# Altium schematic sheet USB-PD.SchDoc
size A3; SheetNumber: 3; SheetTotal: 8
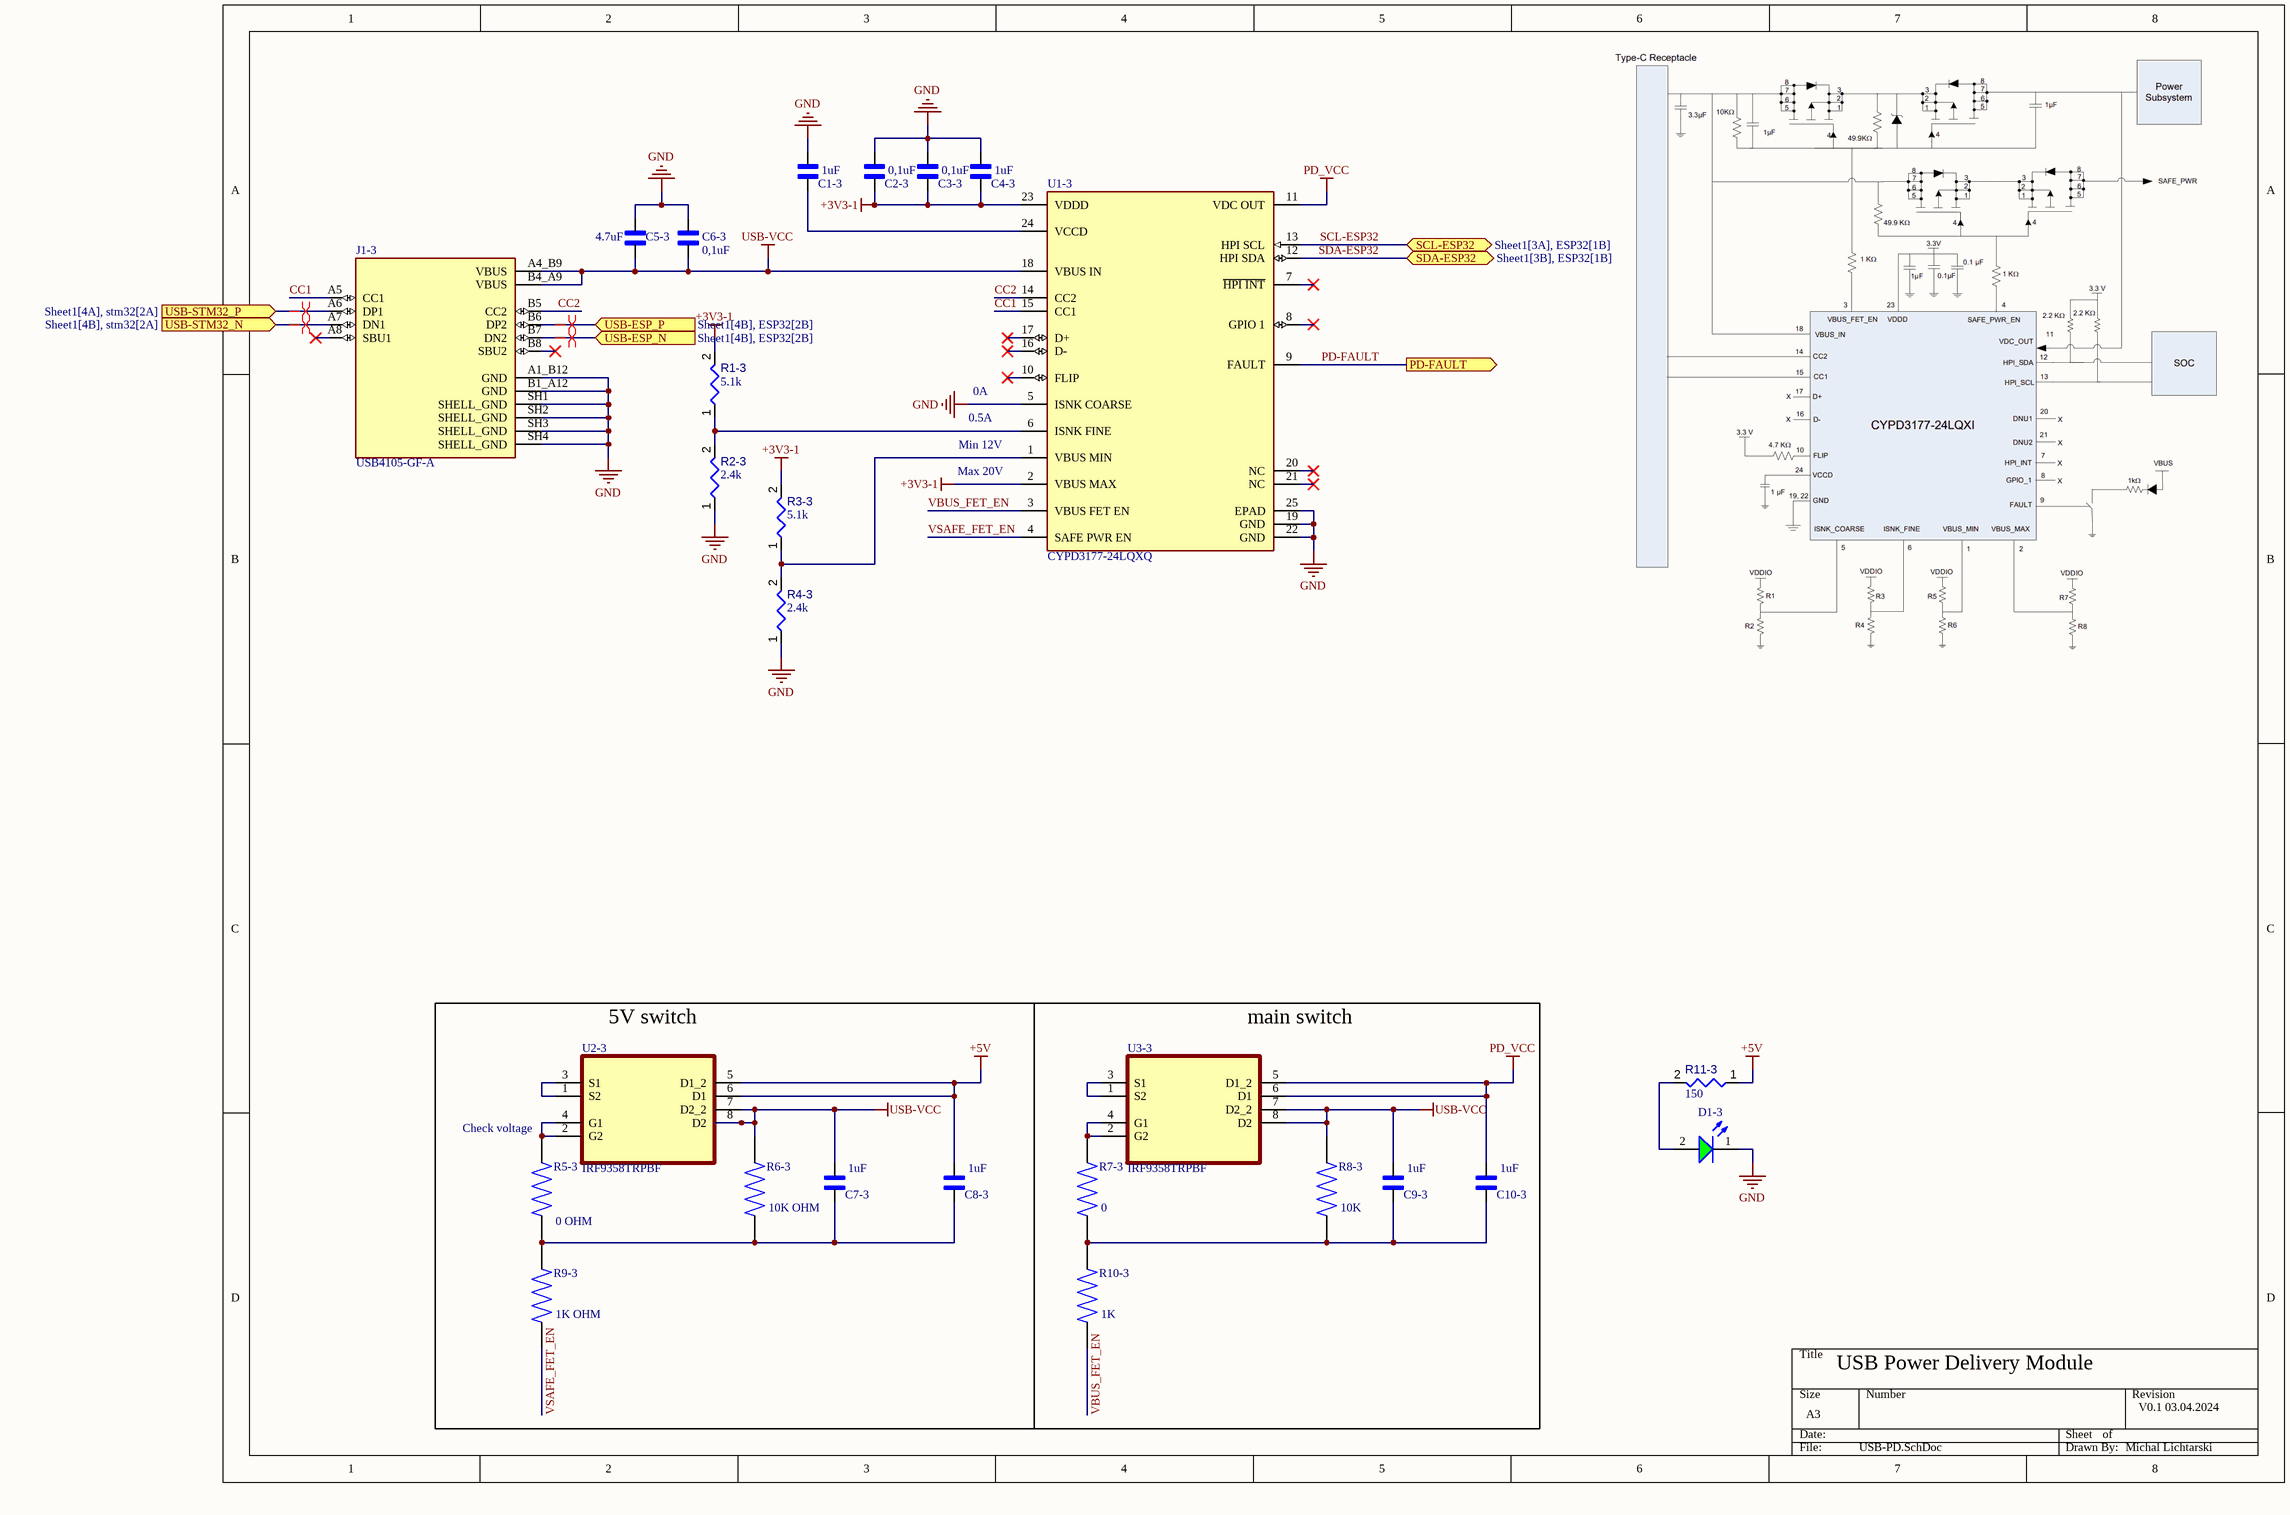
[diagram p0: USB-PD.SchDoc]

## Parts
C1-3  1uF 0603  [CAPC1608X94N]  (value not drawn)
C2-3  0.1uF 0603  [CAPC1608X94N]  (value not drawn)
C3-3  0.1uF 0603  [CAPC1608X94N]  (value not drawn)
C4-3  1uF 0603  [CAPC1608X94N]  (value not drawn)
C5-3  4.7uF 0805 50V  [CAPC2012X140N]  (value not drawn)
C6-3  0.1uF 0603  [CAPC1608X94N]  (value not drawn)
C7-3  1uF 0603  [CAPC1608X94N]  (value not drawn)
C8-3  1uF 0603  [CAPC1608X94N]  (value not drawn)
C9-3  1uF 0603  [CAPC1608X94N]  (value not drawn)
C10-3  1uF 0603  [CAPC1608X94N]  (value not drawn)
D1-3  150060VS75000  [WL-SMCW_0603_150060xx75000]  (value not drawn)
J1-3  USB4105-GF-A  [GCT_USB4105-GF-A]
R1-3  value 5.1k  [RESC1608X55X25ML10T15]  (hidden comment: 5.1k 0603)
R2-3  value 2.4k  [RESC1608X55X25ML10T15]  (hidden comment: 2.4k 0603)
R3-3  value 5.1k  [RESC1608X55X25ML10T15]  (hidden comment: 5.1k 0603)
R4-3  value 2.4k  [RESC1608X55X25ML10T15]  (hidden comment: 2.4k 0603)
R5-3  0 0603  [RES_ERJ-3GEY0R00V]  (value not drawn)
R6-3  10k 0603  [RESC1607X60N]  (value not drawn)
R7-3  0 0603  [RES_ERJ-3GEY0R00V]  (value not drawn)
R8-3  10k 0603  [RESC1607X60N]  (value not drawn)
R9-3  1k 0603  [RES_ERJ3EKF1001V]  (value not drawn)
R10-3  1k 0603  [RES_ERJ3EKF1001V]  (value not drawn)
R11-3  value 150  [RESC1608X55X25ML10T15]  (hidden comment: 150 0603)
U1-3  CYPD3177-24LQXQ  [FP-002-16934-IPC_C]
U2-3  IRF9358TRPBF  [SOIC127P600X175-8N]
U3-3  IRF9358TRPBF  [SOIC127P600X175-8N]

## Ports
PD-FAULT (out, see Sheet1[3B], ESP32[2B]), SCL-ESP32 (bidir, see Sheet1[3A], ESP32[1B]), SDA-ESP32 (bidir, see Sheet1[3B], ESP32[1B]), USB-ESP_N (in, see Sheet1[4B], ESP32[2B]), USB-ESP_P (in, see Sheet1[4B], ESP32[2B]), USB-STM32_N (in, see Sheet1[4B], stm32[2A]), USB-STM32_P (in, see Sheet1[4A], stm32[2A])

## Nets
+3V3-1: C2-3.1 C3-3.1 C4-3.1 R1-3.2 R3-3.2 U1-3.2(VBUS_MAX) U1-3.23(VDDD)
+5V: C8-3.2 R11-3.1 U2-3.5(D1_2) U2-3.6(D1)
GND: C1-3.2 C2-3.2 C3-3.2 C4-3.2 C5-3.1 C6-3.2 D1-3.1(K) J1-3.A1_B12(GND) J1-3.B1_A12(GND) J1-3.SH1(SHELL_GND) J1-3.SH2(SHELL_GND) J1-3.SH3(SHELL_GND) J1-3.SH4(SHELL_GND) R2-3.1 R4-3.1 U1-3.5(ISNK_COARSE) U1-3.19(GND) U1-3.22(GND) U1-3.25(EPAD)
PD_VCC: C10-3.2 U1-3.11(VDC_OUT) U3-3.5(D1_2) U3-3.6(D1)
USB-VCC: C5-3.2 C6-3.1 C7-3.2 C9-3.2 J1-3.A4_B9(VBUS) J1-3.B4_A9(VBUS) R6-3.2 R8-3.2 U1-3.18(VBUS_IN) U2-3.7(D2_2) U2-3.8(D2) U3-3.7(D2_2) U3-3.8(D2)
CC1: J1-3.A5(CC1) U1-3.15(CC1)
CC2: J1-3.B5(CC2) U1-3.14(CC2)
PD-FAULT: U1-3.9(FAULT) ; port PD-FAULT
SCL-ESP32: U1-3.13(HPI_SCL) ; port SCL-ESP32
SDA-ESP32: U1-3.12(HPI_SDA) ; port SDA-ESP32
USB-ESP_N: J1-3.B7(DN2) ; port USB-ESP_N
USB-ESP_P: J1-3.B6(DP2) ; port USB-ESP_P
USB-STM32_N: J1-3.A7(DN1) ; port USB-STM32_N
USB-STM32_P: J1-3.A6(DP1) ; port USB-STM32_P
VBUS_FET_EN: R10-3.1 U1-3.3(VBUS_FET_EN)
VSAFE_FET_EN: R9-3.1 U1-3.4(SAFE_PWR_EN)
NetC1-3_1: C1-3.1 U1-3.24(VCCD)
NetC7-3_1: C7-3.1 C8-3.1 R5-3.1 R6-3.1 R9-3.2
NetC9-3_1: C9-3.1 C10-3.1 R7-3.1 R8-3.1 R10-3.2
NetD1-3_2: D1-3.2(A) R11-3.2
NetR1-3_1: R1-3.1 R2-3.2 U1-3.6(ISNK_FINE)
NetR3-3_1: R3-3.1 R4-3.2 U1-3.1(VBUS_MIN)
NetR5-3_2: R5-3.2 U2-3.2(G2) U2-3.4(G1)
NetR7-3_2: R7-3.2 U3-3.2(G2) U3-3.4(G1)
NetU2-3_1: U2-3.1(S2) U2-3.3(S1)
NetU3-3_1: U3-3.1(S2) U3-3.3(S1)

Not connected (* = marked no-connect by the designer): J1-3 A8(SBU1)* B8(SBU2)*; U1-3 7(~{HPI_INT})* 8(GPIO_1)* 10(FLIP)* 16(D-)* 17(D+)* 20(NC)* 21(NC)*

## Layout directives
differential pair: USB-ESP_N, USB-ESP_P, USB-STM32_N, USB-STM32_P

## Notes on the sheet
- (near C1-3) 1uF
- 0,1uF
- (near C4-3) 1uF
- (near C5-3) 4.7uF
- (near C6-3) 0,1uF
- (near U1-3) Min 12V
- 0.5A
- 0A
- (near U1-3) Max 20V
- 5V switch
- main switch
- Check voltage
- (near C7-3) 1uF
- (near C8-3) 1uF
- (near C9-3) 1uF
- (near C10-3) 1uF
- (near R5-3) 0 OHM
- (near R6-3) 10K OHM
- (near R7-3) 0
- (near R8-3) 10K
- (near R9-3) 1K OHM
- (near R10-3) 1K
- USB Power Delivery Module
- V0.1 03.04.2024
- Michal Lichtarski

## Library data of the parts
C1-3 C2-3 C3-3 C4-3 C8-3 C9-3 C10-3 = 06035C105KAT2A: MF: {'manufacturer': u'KYOCERA AVX Components Corporation'}; Package: None; Price: None; Value: *; MP: 06035C105KAT2A; Availability: Unavailable
C5-3 = CL21A475KBQNNNE: Cap Ceramic 4.7uF 50V X5R 10% SMD 0805 85Â°C Embossed Plastic T/R; MF: {'manufacturer': u'Samsung Electro-Mechanics'}; Package: None; Price: None; Value: *; MP: CL21A475KBQNNNE; Availability: Unavailable
C6-3 = 06035C105KAT2A: CAP CER 0.1UF 16V X7R 0603; MF: {'manufacturer': u'KYOCERA AVX Components Corporation'}; Package: None; Price: None; Value: *; MP: 06035C105KAT2A; Availability: Unavailable
C7-3 = 06035C105KAT2A: CAP CER 1UF 50V X5R 0603; MF: {'manufacturer': u'KYOCERA AVX Components Corporation'}; Package: None; Price: None; Value: *; MP: 06035C105KAT2A; Availability: Unavailable
D1-3 = CMP-1426-00006-6: NexarPartId: 29717778; Reverse Voltage: 5V; Forward Voltage: 2V; Viewing Angle: 140°; Luminous Intensity: 40mcd; Test Current: 20mA; Max Junction Temperature (Tj): 95°C; Wavelength: 570nm; Forward Current: 100mA; Color: Green; Lens Style: Clear, Rectangular; Power Dissipation: 72mW; Peak Wavelength: 572nm; Packaging: Tape and Reel; REACH SVHC: Unknown; Width: 800µm; Max Operating Temperature: 85°C; Number of Pins: 2; RoHS: Compliant; Dominant Wavelength: 570nm; Min Operating Temperature: -40°C; Case Code (Imperial): 0603; Height: 700µm; Length: 1.6mm; Case Code (Metric): 1608; Case/Package: 0603; Max Reverse Voltage (DC): 5V; Mount: Surface Mount
J1-3 = USB4105-GF-A: MF: {'manufacturer': u'GCT'}; Package: None; Price: None; Value: *; MP: USB4105-GF-A; Availability: Unavailable
R1-3 R2-3 R3-3 R4-3 R11-3 = CMP-009-00031-5: Tolerance: 1%; Power: 100mW; Mounting Technology: SM; Case/Package: 0603; RoHS Compliant: True; Pins: 2; Min Operating Temperature: -55°C; Max Operating Temperature: 155°C
R5-3 R7-3 = ERJ-3GEY0R00V: MF: {'manufacturer': u'Panasonic'}; Package: None; Price: None; Value: *; MP: ERJ-3GEY0R00V; Availability: Unavailable
R6-3 R8-3 = RC0603FR-0710KL: MF: {'manufacturer': u'Yageo'}; Package: None; Price: None; Value: *; MP: RC0603FR-0710KL; Availability: Unavailable
R9-3 = ERJ3EKF1001V: MF: {'manufacturer': u'Panasonic'}; Package: None; Price: None; Value: *; MP: ERJ3EKF1001V; Availability: Unavailable
R10-3 = ERJ3EKF1001V: RES SMD 1K OHM 1% 1/10W 0603; MF: {'manufacturer': u'Panasonic'}; Package: None; Price: None; Value: *; MP: ERJ3EKF1001V; Availability: Unavailable
U1-3 = CMP-12917-000005-1: IC USB TYPE-C PORT CONTROL 24QFN
U2-3 U3-3 = IRF9358TRPBF: HEXFET Power MOSFET; MF: {'manufacturer': u'Infineon'}; Package: None; Price: None; Value: *; MP: IRF9358TRPBF; Availability: Unavailable